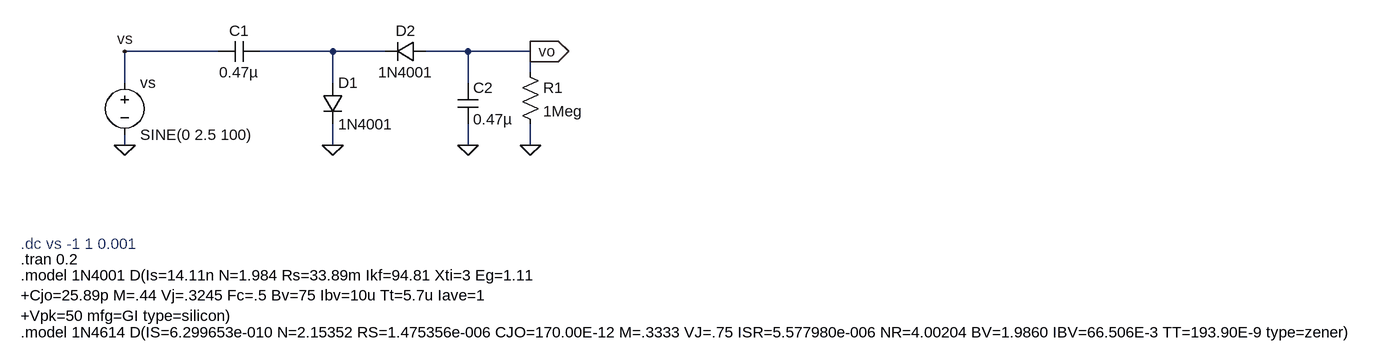
[diagram p0: schematic Lab6p6.asc]
Lab6p6.asc, the LTspice schematic file:
Version 4
SHEET 1 2280 680
WIRE 304 16 160 16
WIRE 480 16 368 16
WIRE 560 16 480 16
WIRE 688 16 624 16
WIRE 784 16 688 16
WIRE 784 48 784 16
WIRE 160 64 160 16
WIRE 480 64 480 16
WIRE 688 64 688 16
WIRE 160 160 160 144
WIRE 480 160 480 128
WIRE 688 160 688 128
WIRE 784 160 784 128
FLAG 160 160 0
FLAG 784 16 vo
IOPIN 784 16 Out
FLAG 160 16 vs
FLAG 784 160 0
FLAG 480 160 0
FLAG 688 160 0
SYMBOL voltage 160 48 R0
WINDOW 123 0 0 Left 0
WINDOW 39 0 0 Left 0
SYMATTR InstName vs
SYMATTR Value SINE(0 2.5 100)
SYMBOL res 768 32 R0
SYMATTR InstName R1
SYMATTR Value 1Meg
SYMBOL cap 368 0 R90
WINDOW 0 0 32 VBottom 2
WINDOW 3 32 32 VTop 2
SYMATTR InstName C1
SYMATTR Value 0.47µ
SYMBOL diode 464 64 R0
SYMATTR InstName D1
SYMATTR Value 1N4001
SYMBOL diode 624 0 R90
WINDOW 0 0 32 VBottom 2
WINDOW 3 32 32 VTop 2
SYMATTR InstName D2
SYMATTR Value 1N4001
SYMBOL cap 672 64 R0
SYMATTR InstName C2
SYMATTR Value 0.47µ
TEXT 0 360 Left 2 !.model 1N4001 D(Is=14.11n N=1.984 Rs=33.89m Ikf=94.81 Xti=3 Eg=1.11\n+Cjo=25.89p M=.44 Vj=.3245 Fc=.5 Bv=75 Ibv=10u Tt=5.7u Iave=1\n+Vpk=50 mfg=GI type=silicon)
TEXT 0 336 Left 2 !.tran 0.2
TEXT 0 312 Left 2 ;.dc vs -1 1 0.001
TEXT 0 448 Left 2 !.model 1N4614 D(IS=6.299653e-010 N=2.15352 RS=1.475356e-006 CJO=170.00E-12 M=.3333 VJ=.75 ISR=5.577980e-006 NR=4.00204 BV=1.9860 IBV=66.506E-3 TT=193.90E-9 type=zener)

The netlist it stands for:
* Lab6p6.asc
vs vs 0 SINE(0 2.5 100)
R1 vo 0 1Meg
C1 N001 vs 0.47µ
D1 N001 0 1N4001
D2 vo N001 1N4001
C2 vo 0 0.47µ
.model D D
.lib standard.dio
.model 1N4001 D(Is=14.11n N=1.984 Rs=33.89m Ikf=94.81 Xti=3 Eg=1.11
+Cjo=25.89p M=.44 Vj=.3245 Fc=.5 Bv=75 Ibv=10u Tt=5.7u Iave=1
+Vpk=50 mfg=GI type=silicon)
.tran 0.2
* .dc vs -1 1 0.001
.model 1N4614 D(IS=6.299653e-010 N=2.15352 RS=1.475356e-006 CJO=170.00E-12 M=.3333 VJ=.75 ISR=5.577980e-006 NR=4.00204 BV=1.9860 IBV=66.506E-3 TT=193.90E-9 type=zener)
.backanno
.end